# Altium schematic sheet Driving.SchDoc: Sterowanie LED
size A4; Author: Jakub Wiczynski; Organization: Simle; Revision: 1; ProjectName: Symulator
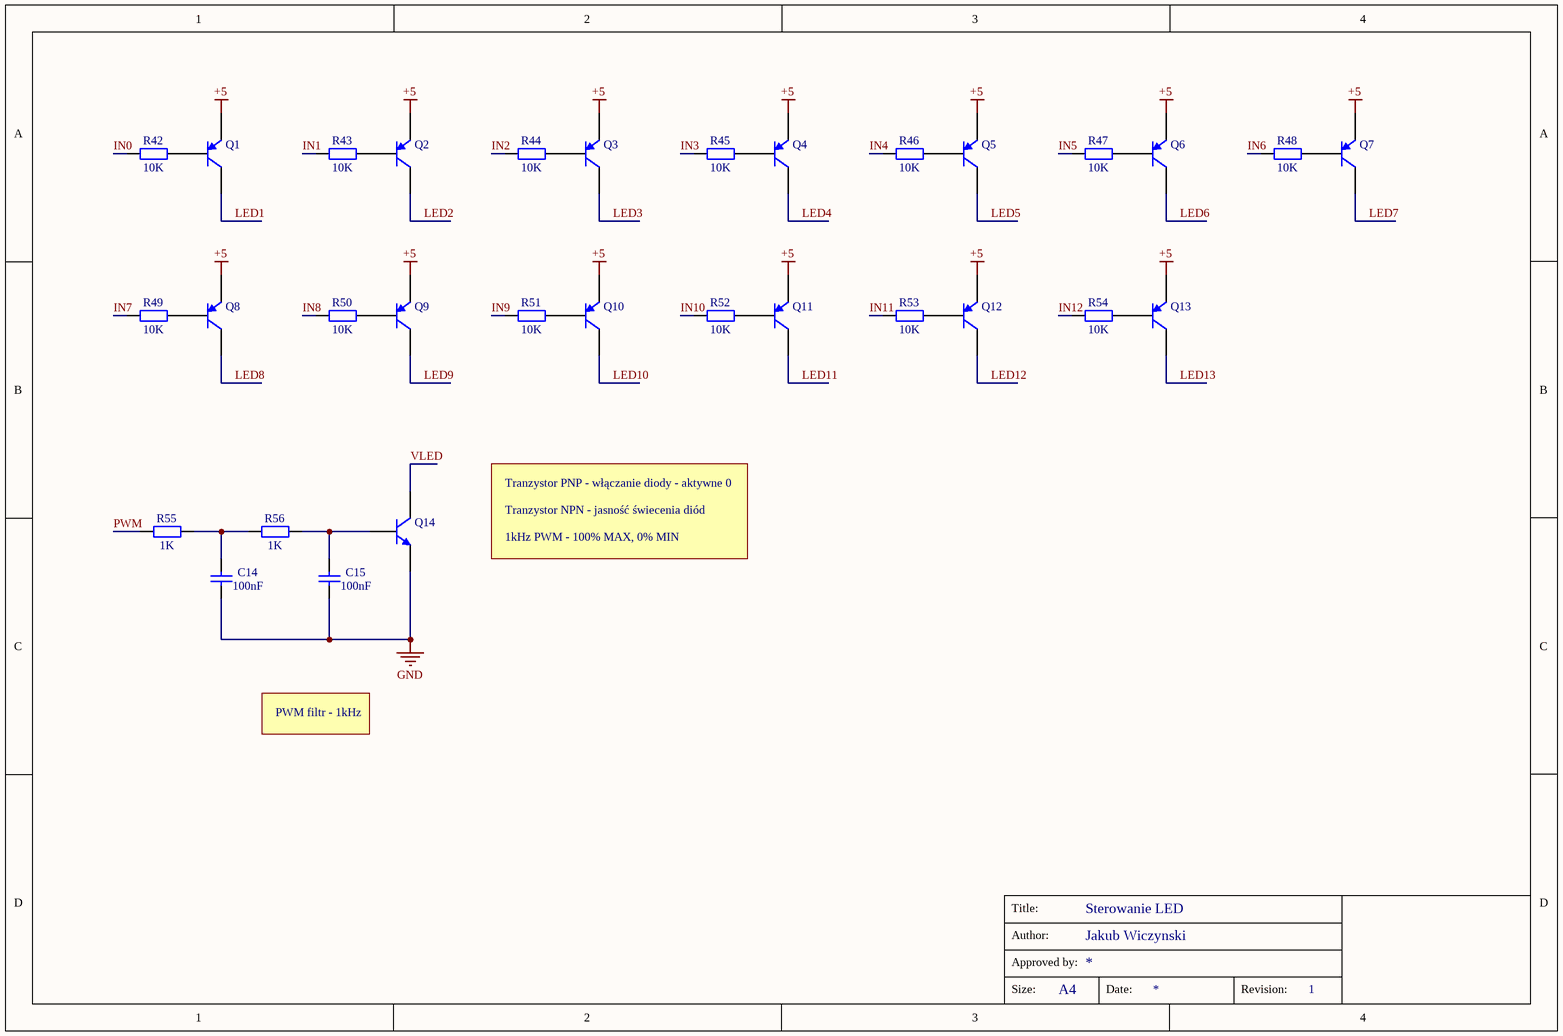
[diagram p0: Driving.SchDoc]

## Parts
C14  value 100nF  [C1206]  (hidden comment: http://www.tme.eu/pl/details/12061c104kat2a/kondensatory-mlcc-smd-1206/avx/)
C15  value 100nF  [C1206]  (hidden comment: http://www.tme.eu/pl/details/12061c104kat2a/kondensatory-mlcc-smd-1206/avx/)
Q1  http://www.tme.eu/pl/details/bc856a/tranzystory-pnp-smd/nexperia/bc856a215/  [SOT-23B_N]  (value not drawn)
Q2  http://www.tme.eu/pl/details/bc856a/tranzystory-pnp-smd/nexperia/bc856a215/  [SOT-23B_N]  (value not drawn)
Q3  http://www.tme.eu/pl/details/bc856a/tranzystory-pnp-smd/nexperia/bc856a215/  [SOT-23B_N]  (value not drawn)
Q4  http://www.tme.eu/pl/details/bc856a/tranzystory-pnp-smd/nexperia/bc856a215/  [SOT-23B_N]  (value not drawn)
Q5  http://www.tme.eu/pl/details/bc856a/tranzystory-pnp-smd/nexperia/bc856a215/  [SOT-23B_N]  (value not drawn)
Q6  http://www.tme.eu/pl/details/bc856a/tranzystory-pnp-smd/nexperia/bc856a215/  [SOT-23B_N]  (value not drawn)
Q7  http://www.tme.eu/pl/details/bc856a/tranzystory-pnp-smd/nexperia/bc856a215/  [SOT-23B_N]  (value not drawn)
Q8  http://www.tme.eu/pl/details/bc856a/tranzystory-pnp-smd/nexperia/bc856a215/  [SOT-23B_N]  (value not drawn)
Q9  http://www.tme.eu/pl/details/bc856a/tranzystory-pnp-smd/nexperia/bc856a215/  [SOT-23B_N]  (value not drawn)
Q10  http://www.tme.eu/pl/details/bc856a/tranzystory-pnp-smd/nexperia/bc856a215/  [SOT-23B_N]  (value not drawn)
Q11  http://www.tme.eu/pl/details/bc856a/tranzystory-pnp-smd/nexperia/bc856a215/  [SOT-23B_N]  (value not drawn)
Q12  http://www.tme.eu/pl/details/bc856a/tranzystory-pnp-smd/nexperia/bc856a215/  [SOT-23B_N]  (value not drawn)
Q13  http://www.tme.eu/pl/details/bc856a/tranzystory-pnp-smd/nexperia/bc856a215/  [SOT-23B_N]  (value not drawn)
Q14  http://www.tme.eu/pl/details/bc817-16.215/tranzystory-npn-smd/nexperia/  [SOT-23B_N]  (value not drawn)
R42  value 10K  [C1206]  (hidden comment: http://www.tme.eu/pl/details/crcw120610k0jntabc/rezystory-smd-1206/vishay/)
R43  value 10K  [C1206]  (hidden comment: http://www.tme.eu/pl/details/crcw120610k0jntabc/rezystory-smd-1206/vishay/)
R44  value 10K  [C1206]  (hidden comment: http://www.tme.eu/pl/details/crcw120610k0jntabc/rezystory-smd-1206/vishay/)
R45  value 10K  [C1206]  (hidden comment: http://www.tme.eu/pl/details/crcw120610k0jntabc/rezystory-smd-1206/vishay/)
R46  value 10K  [C1206]  (hidden comment: http://www.tme.eu/pl/details/crcw120610k0jntabc/rezystory-smd-1206/vishay/)
R47  value 10K  [C1206]  (hidden comment: http://www.tme.eu/pl/details/crcw120610k0jntabc/rezystory-smd-1206/vishay/)
R48  value 10K  [C1206]  (hidden comment: http://www.tme.eu/pl/details/crcw120610k0jntabc/rezystory-smd-1206/vishay/)
R49  value 10K  [C1206]  (hidden comment: http://www.tme.eu/pl/details/crcw120610k0jntabc/rezystory-smd-1206/vishay/)
R50  value 10K  [C1206]  (hidden comment: http://www.tme.eu/pl/details/crcw120610k0jntabc/rezystory-smd-1206/vishay/)
R51  value 10K  [C1206]  (hidden comment: http://www.tme.eu/pl/details/crcw120610k0jntabc/rezystory-smd-1206/vishay/)
R52  value 10K  [C1206]  (hidden comment: http://www.tme.eu/pl/details/crcw120610k0jntabc/rezystory-smd-1206/vishay/)
R53  value 10K  [C1206]  (hidden comment: http://www.tme.eu/pl/details/crcw120610k0jntabc/rezystory-smd-1206/vishay/)
R54  value 10K  [C1206]  (hidden comment: http://www.tme.eu/pl/details/crcw120610k0jntabc/rezystory-smd-1206/vishay/)
R55  value 1K  [C1206]  (hidden comment: http://www.tme.eu/pl/details/crcw12061k00fkea/rezystory-smd-1206/vishay/)
R56  value 1K  [C1206]  (hidden comment: http://www.tme.eu/pl/details/crcw12061k00fkea/rezystory-smd-1206/vishay/)

## Nets
+5: Q1.3(E) Q2.3(E) Q3.3(E) Q4.3(E) Q5.3(E) Q6.3(E) Q7.3(E) Q8.3(E) Q9.3(E) Q10.3(E) Q11.3(E) Q12.3(E) Q13.3(E)
GND: C14.1 C15.1 Q14.3(E)
IN0: R42.1
IN1: R43.1
IN2: R44.1
IN3: R45.1
IN4: R46.1
IN5: R47.1
IN6: R48.1
IN7: R49.1
IN8: R50.1
IN9: R51.1
IN10: R52.1
IN11: R53.1
IN12: R54.1
LED1: Q1.1(C)
LED2: Q2.1(C)
LED3: Q3.1(C)
LED4: Q4.1(C)
LED5: Q5.1(C)
LED6: Q6.1(C)
LED7: Q7.1(C)
LED8: Q8.1(C)
LED9: Q9.1(C)
LED10: Q10.1(C)
LED11: Q11.1(C)
LED12: Q12.1(C)
LED13: Q13.1(C)
PWM: R55.1
VLED: Q14.1(C)
NetC14_2: C14.2 R55.2 R56.1
NetC15_2: C15.2 Q14.2(B) R56.2
NetQ1_2: Q1.2(B) R42.2
NetQ2_2: Q2.2(B) R43.2
NetQ3_2: Q3.2(B) R44.2
NetQ4_2: Q4.2(B) R45.2
NetQ5_2: Q5.2(B) R46.2
NetQ6_2: Q6.2(B) R47.2
NetQ7_2: Q7.2(B) R48.2
NetQ8_2: Q8.2(B) R49.2
NetQ9_2: Q9.2(B) R50.2
NetQ10_2: Q10.2(B) R51.2
NetQ11_2: Q11.2(B) R52.2
NetQ12_2: Q12.2(B) R53.2
NetQ13_2: Q13.2(B) R54.2

## Notes on the sheet
- Tranzystor PNP - włączanie diody - aktywne 0
- Tranzystor NPN - jasność świecenia diód
- 1kHz PWM - 100% MAX, 0% MIN
- PWM filtr - 1kHz
- Title:
- Author:
- Approved by:
- Size:
- A4
- Date:
- Revision:

## Library data of the parts
C14 C15 = Cap: 100nF; Published: 8-Jun-2000; LatestRevisionDate: 17-Jul-2002; LatestRevisionNote: Re-released for DXP Platform.; PackageReference: RAD-0.3; Publisher: Altium Limited; PackageDescription: Radial Cap, Thru-Hole; 2 Leads; 0.3 in Pin Spacing
Q1-Q13 = PNP: PNP 100mA; Published: 8-Jun-2000; LatestRevisionDate: 29-May-2009; LatestRevisionNote: IPC-7351 Footprint Added.; PackageVersion: Aug-1999; PackageReference: SOT-23B; Publisher: Altium Limited; PackageDescription: 3-Pin SOT-23 Package 0.95 mm Pitch, 2.4 mm Lead Span
Q14 = NPN: NPN 500mA; Published: 8-Jun-2000; LatestRevisionDate: 17-Jul-2002; LatestRevisionNote: Re-released for DXP Platform.; PackageReference: TO-226-AA; Publisher: Altium Limited; PackageDescription: TO, Flat Index; 3 In-Line, Axial Leads; Body Dia. 4.8mm; Leads 0.55 x 0.51 mm (max); Code_JEDEC: TO-226-AA
R42-R54 = Res2: 10K; Published: 8-Jun-2000; LatestRevisionDate: 17-Jul-2002; LatestRevisionNote: Re-released for DXP Platform.; PackageReference: AXIAL-0.4; Publisher: Altium Limited; PackageDescription: Axial Device, Thru-Hole; 2 Leads; 0.4 in Pin Spacing
R55 R56 = Res2: 1K; Published: 8-Jun-2000; LatestRevisionDate: 17-Jul-2002; LatestRevisionNote: Re-released for DXP Platform.; PackageReference: AXIAL-0.4; Publisher: Altium Limited; PackageDescription: Axial Device, Thru-Hole; 2 Leads; 0.4 in Pin Spacing